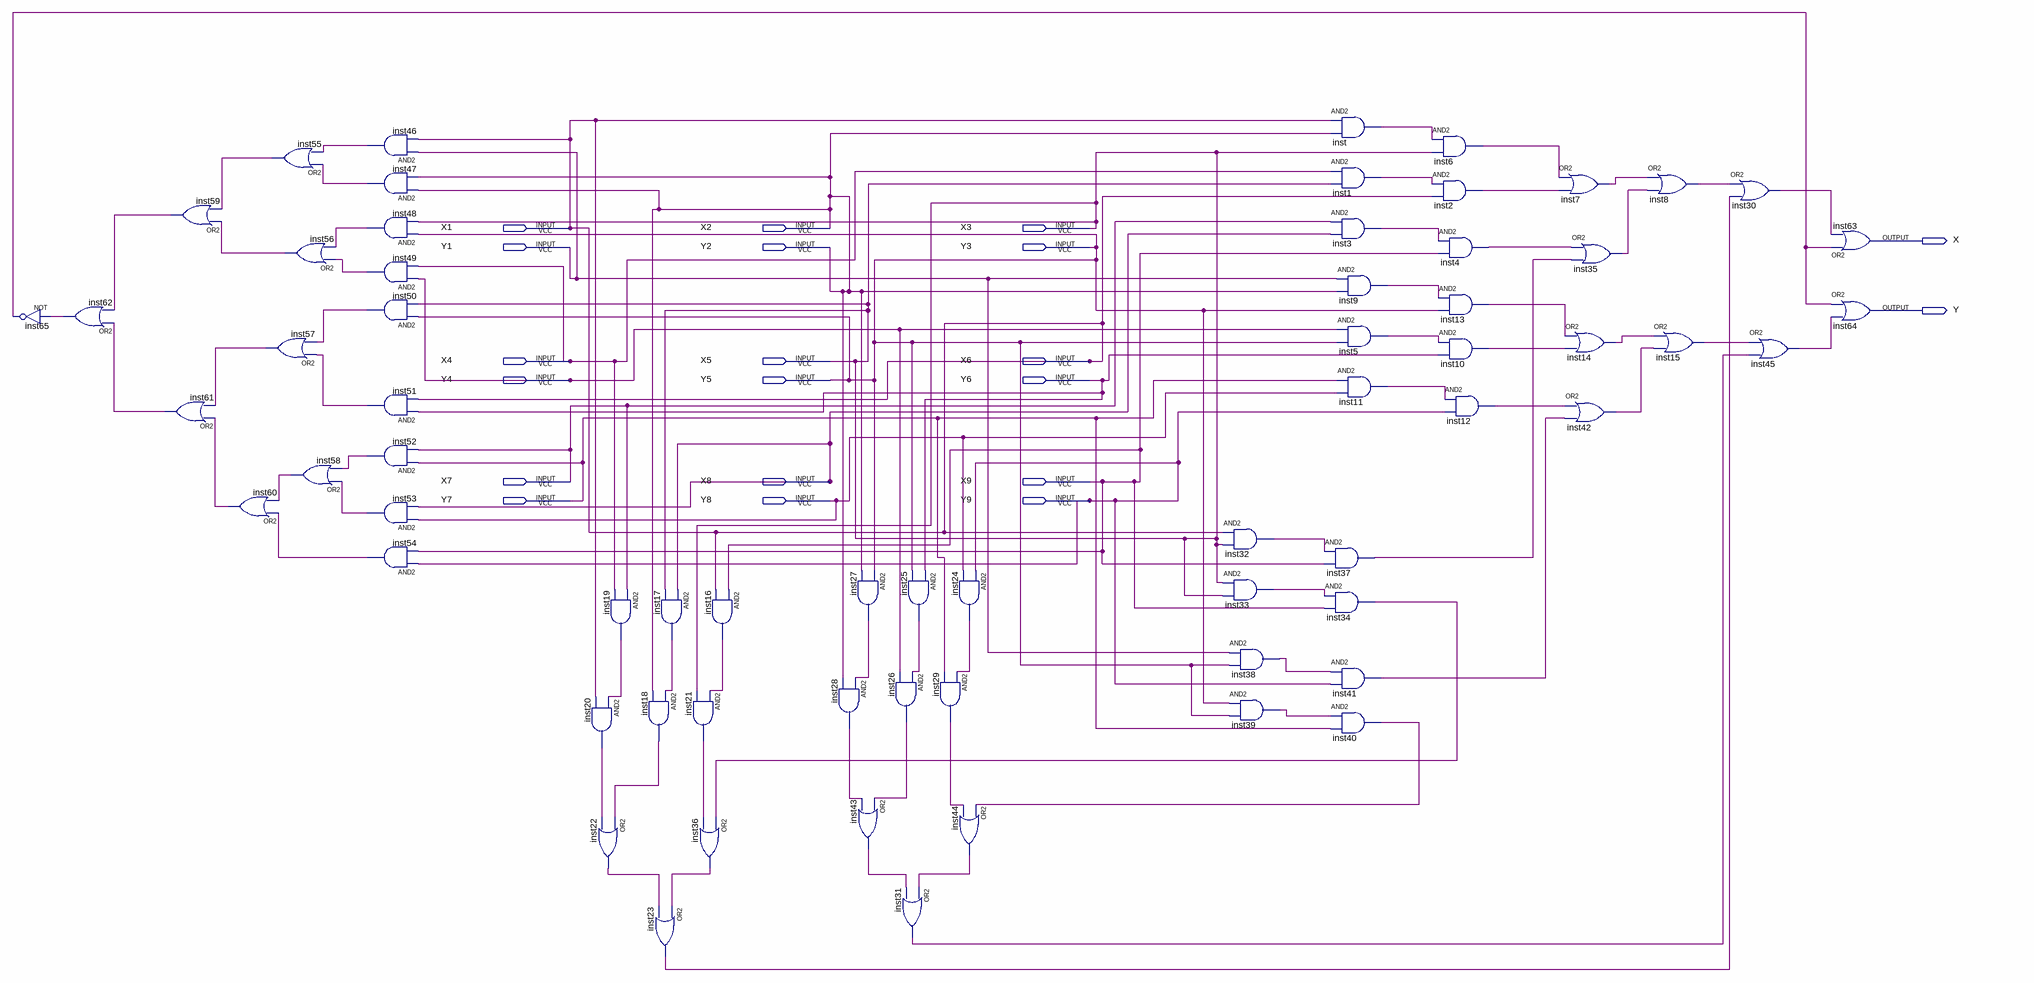
[diagram p0: schematic sheet]
// Quartus schematic tictactoe.bdf as structural Verilog: 66 symbols, 20 pins
module tictactoe (
  input  X1,
  input  X2,
  input  X3,
  input  Y1,
  input  Y2,
  input  Y3,
  input  X4,
  input  X5,
  input  X6,
  input  Y4,
  input  Y5,
  input  Y6,
  input  X7,
  input  X8,
  input  X9,
  input  Y7,
  input  Y8,
  input  Y9,
  output X,
  output Y
);

  wire inst1_out, inst2_out, inst3_out, inst4_out, inst5_out, inst6_out, inst7_out, inst8_out, inst9_out,
       inst10_out, inst11_out, inst12_out, inst13_out, inst14_out, inst15_out, inst16_out, inst17_out,
       inst18_out, inst19_out, inst20_out, inst21_out, inst22_out, inst23_out, inst24_out, inst25_out,
       inst26_out, inst27_out, inst28_out, inst29_out, inst30_out, inst31_out, inst32_out, inst33_out,
       inst34_out, inst35_out, inst36_out, inst37_out, inst38_out, inst39_out, inst40_out, inst41_out,
       inst42_out, inst43_out, inst44_out, inst45_out, inst46_out, inst47_out, inst48_out, inst49_out,
       inst50_out, inst51_out, inst52_out, inst53_out, inst54_out, inst55_out, inst56_out, inst57_out,
       inst58_out, inst59_out, inst60_out, inst61_out, inst62_out, inst65_out, inst_out;

  not inst65 (inst65_out, inst62_out);
  or inst62 (inst62_out, inst61_out, inst59_out);
  or inst59 (inst59_out, inst56_out, inst55_out);
  or inst61 (inst61_out, inst60_out, inst57_out);
  or inst60 (inst60_out, inst54_out, inst58_out);
  or inst55 (inst55_out, inst47_out, inst46_out);
  or inst56 (inst56_out, inst49_out, inst48_out);
  or inst57 (inst57_out, inst51_out, inst50_out);
  or inst58 (inst58_out, inst53_out, inst52_out);
  and inst46 (inst46_out, Y1, X1);
  and inst47 (inst47_out, X2, X2);
  and inst48 (inst48_out, Y3, X3);
  and inst49 (inst49_out, Y4, X4);
  and inst50 (inst50_out, Y3, X3);
  and inst51 (inst51_out, Y6, X1);
  and inst52 (inst52_out, Y7, X7);
  and inst53 (inst53_out, Y8, X8);
  and inst54 (inst54_out, Y9, X9);
  and inst19 (inst19_out, X7, X4);
  and inst20 (inst20_out, inst19_out, X1);
  or inst22 (inst22_out, inst18_out, inst20_out);
  and inst17 (inst17_out, X8, X3);
  and inst18 (inst18_out, inst17_out, X2);
  or inst23 (inst23_out, inst36_out, inst22_out);
  and inst16 (inst16_out, X9, X1);
  and inst21 (inst21_out, inst16_out, X3);
  or inst36 (inst36_out, inst34_out, inst21_out);
  and inst27 (inst27_out, Y3, X2);
  and inst28 (inst28_out, inst27_out, X2);
  or inst43 (inst43_out, inst26_out, inst28_out);
  and inst25 (inst25_out, Y6, Y3);
  and inst26 (inst26_out, inst25_out, Y4);
  or inst31 (inst31_out, inst44_out, inst43_out);
  and inst24 (inst24_out, Y9, Y8);
  and inst29 (inst29_out, inst24_out, Y7);
  or inst44 (inst44_out, inst40_out, inst29_out);
  and inst32 (inst32_out, X1, X3);
  and inst33 (inst33_out, X3, X3);
  and inst38 (inst38_out, Y1, Y3);
  and inst39 (inst39_out, Y3, Y3);
  and inst (inst_out, X1, X2);
  and inst1 (inst1_out, X4, X3);
  and inst3 (inst3_out, X7, X8);
  and inst9 (inst9_out, Y1, X2);
  and inst5 (inst5_out, Y4, Y3);
  and inst11 (inst11_out, Y7, Y8);
  and inst37 (inst37_out, inst32_out, X9);
  and inst34 (inst34_out, inst33_out, X9);
  and inst41 (inst41_out, inst38_out, Y9);
  and inst40 (inst40_out, inst39_out, Y7);
  and inst6 (inst6_out, inst_out, X3);
  and inst2 (inst2_out, inst1_out, X1);
  and inst4 (inst4_out, inst3_out, X9);
  and inst13 (inst13_out, inst9_out, Y3);
  and inst10 (inst10_out, inst5_out, Y6);
  and inst12 (inst12_out, inst11_out, Y9);
  or inst7 (inst7_out, inst6_out, inst2_out);
  or inst35 (inst35_out, inst4_out, inst37_out);
  or inst14 (inst14_out, inst13_out, inst10_out);
  or inst42 (inst42_out, inst12_out, inst41_out);
  or inst8 (inst8_out, inst7_out, inst35_out);
  or inst15 (inst15_out, inst14_out, inst42_out);
  or inst30 (inst30_out, inst8_out, inst23_out);
  or inst45 (inst45_out, inst15_out, inst31_out);
  or inst63 (X, inst65_out, inst30_out);
  or inst64 (Y, inst65_out, inst45_out);

  assign X5 = X3;
  assign X6 = X1;
  assign Y2 = X2;
  assign Y5 = Y3;
endmodule
